# EAGLE design ioboard (EAGLE 9.6.2)
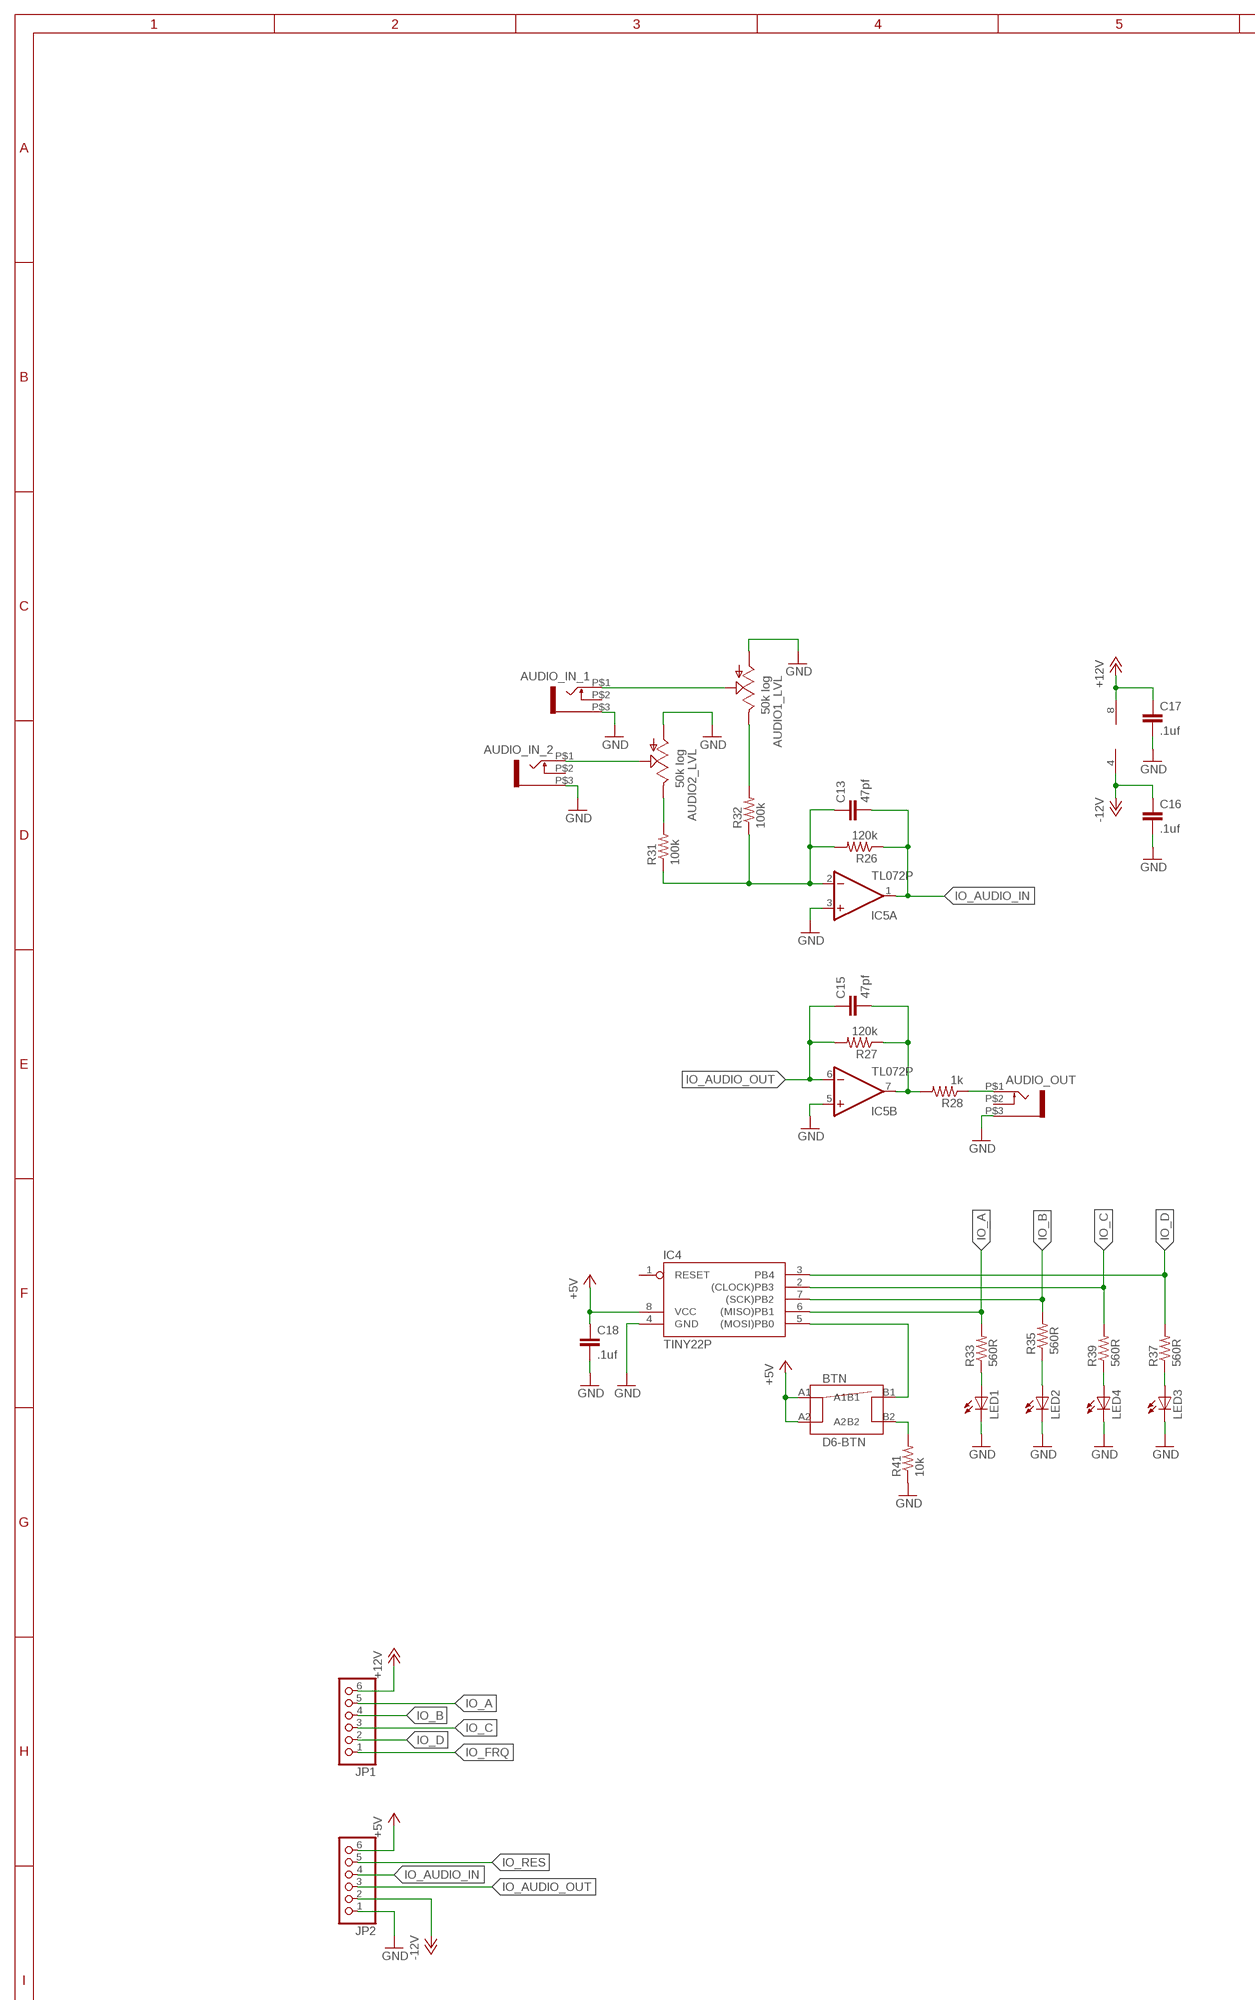
[diagram p0: schematic, sheet 1, part 1 of 2]
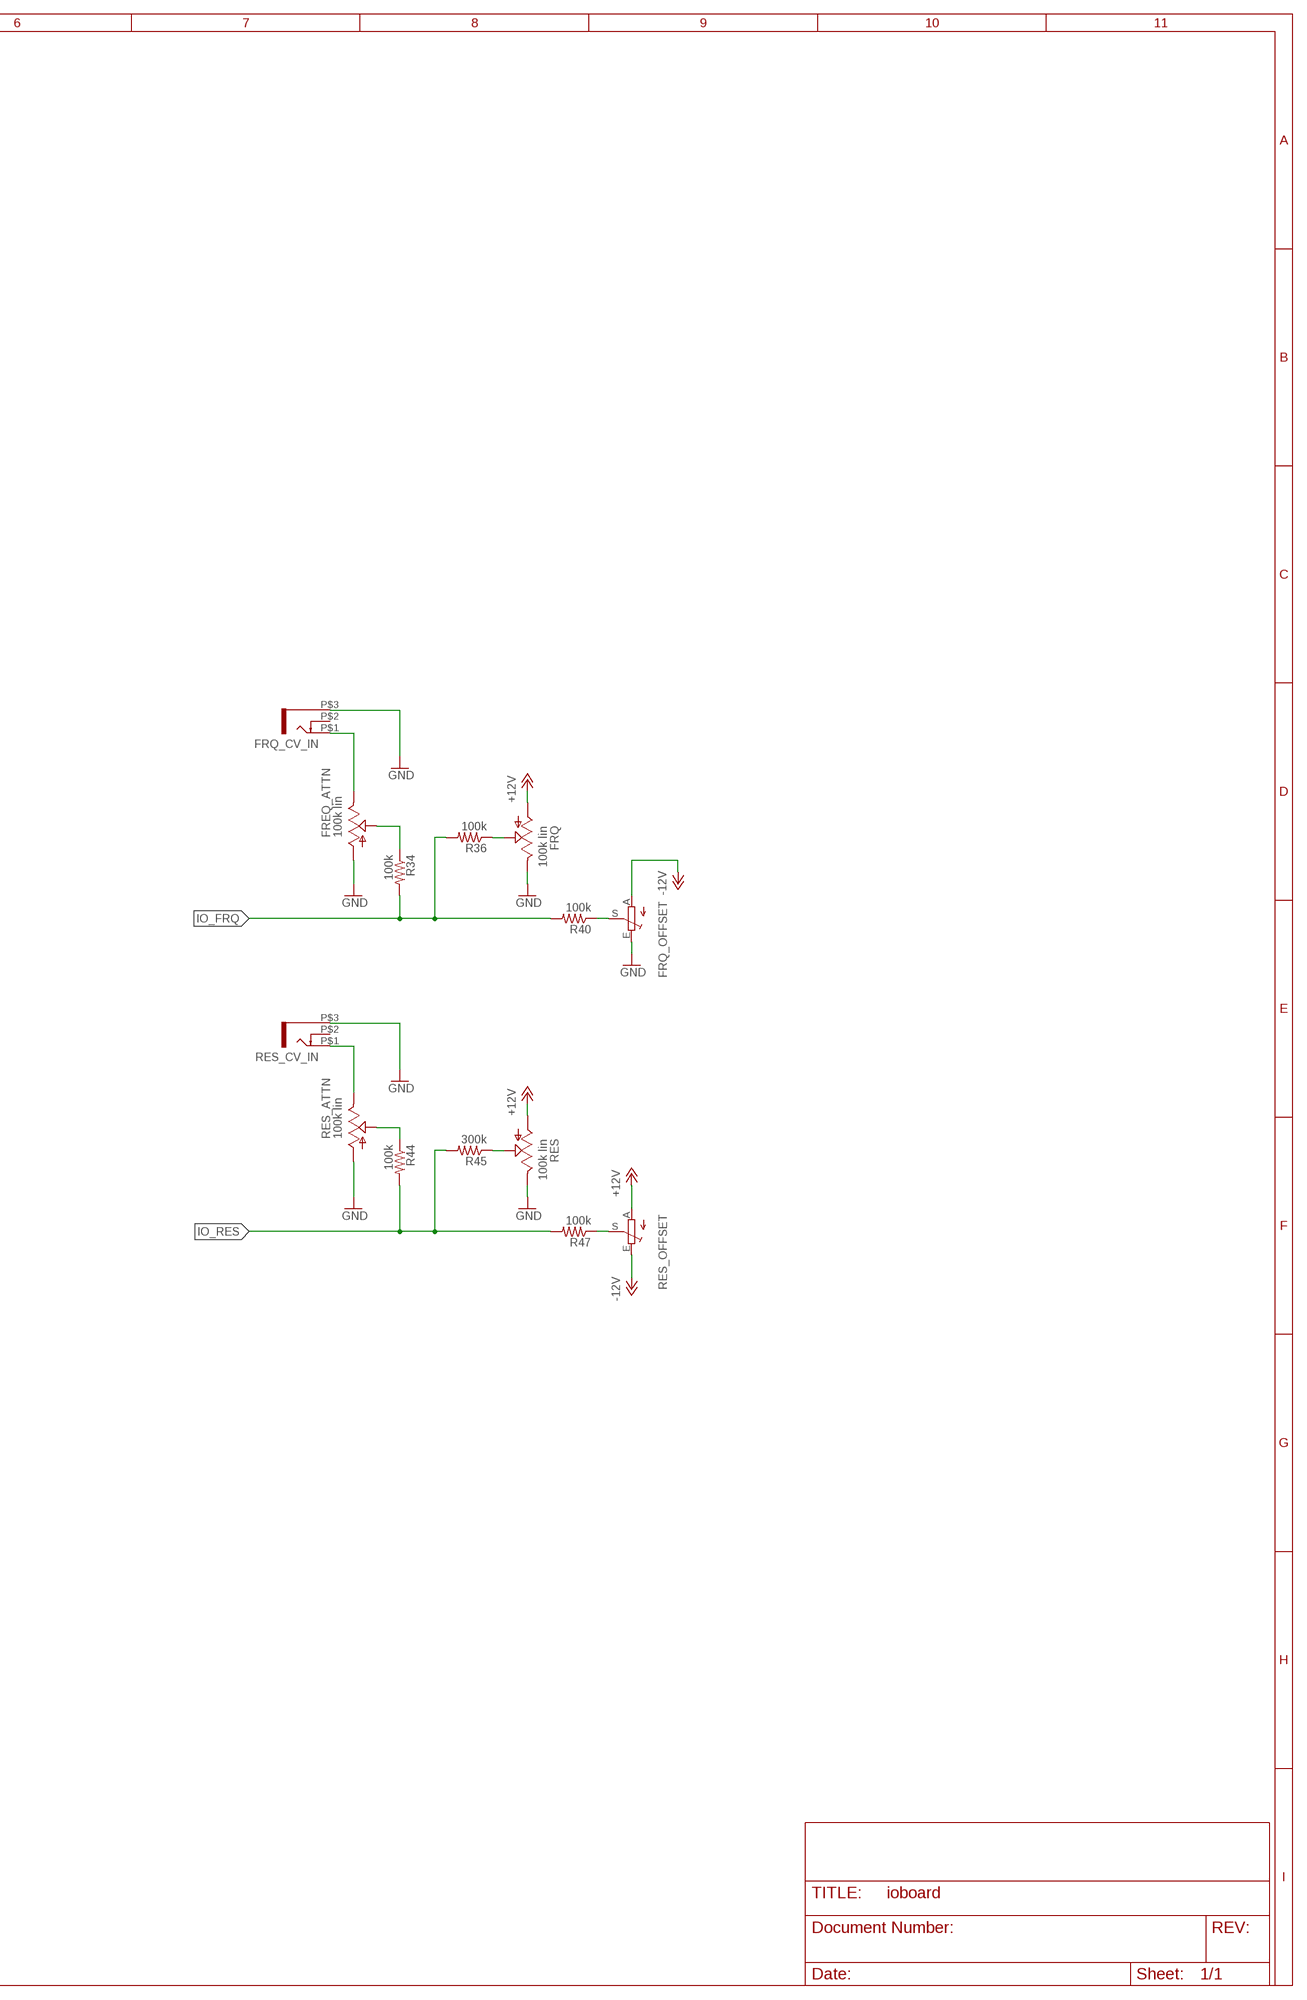
[diagram p1: schematic, sheet 1, part 2 of 2]

## Parts
AUDIO1_LVL  50k log  ALPHA-9MMA  [EVUF]
AUDIO2_LVL  50k log  ALPHA-9MMA  [EVUF]
AUDIO_IN_1  WQP-PJ301M-12_JACK  [WQP-PJ301M-12_JACK]
AUDIO_IN_2  WQP-PJ301M-12_JACK  [WQP-PJ301M-12_JACK]
AUDIO_OUT  WQP-PJ301M-12_JACK  [WQP-PJ301M-12_JACK]
BTN  D6-BTN  [D6-BTN]
C13  47pf  C-EU050-024X044  [C050-024X044]
C15  47pf  C-EU050-024X044  [C050-024X044]
C16  .1uf  C-EU050-024X044  [C050-024X044]
C17  .1uf  C-EU050-024X044  [C050-024X044]
C18  .1uf  C-EU050-024X044  [C050-024X044]
FREQ_ATTN  100k lin  ALPHA-9MMA  [EVUF]
FRQ  100k lin  ALPHA-9MMA  [EVUF]
FRQ_CV_IN  WQP-PJ301M-12_JACK  [WQP-PJ301M-12_JACK]
FRQ_OFFSET  TRIM_EU-B25P  [B25P]
IC4  TINY22P  [DIL08]
IC5  TL072P  [DIL08]
JP1  PINHD-1X6  [1X06]
JP2  PINHD-1X6  [1X06]
LED1  LED3MM  [LED3MM]
LED2  LED3MM  [LED3MM]
LED3  LED3MM  [LED3MM]
LED4  LED3MM  [LED3MM]
R26  120k  R-US_0207/7  [0207/7]
R27  120k  R-US_0207/7  [0207/7]
R28  1k  R-US_0207/7  [0207/7]
R31  100k  R-US_0207/7  [0207/7]
R32  100k  R-US_0207/7  [0207/7]
R33  560R  R-US_0207/7  [0207/7]
R34  100k  R-US_0207/7  [0207/7]
R35  560R  R-US_0207/7  [0207/7]
R36  100k  R-US_0207/7  [0207/7]
R37  560R  R-US_0207/7  [0207/7]
R39  560R  R-US_0207/7  [0207/7]
R40  100k  R-US_0207/7  [0207/7]
R41  10k  R-US_0207/7  [0207/7]
R44  100k  R-US_0207/7  [0207/7]
R45  300k  R-US_0207/7  [0207/7]
R47  100k  R-US_0207/7  [0207/7]
RES  100k lin  ALPHA-9MMA  [EVUF]
RES_ATTN  100k lin  ALPHA-9MMA  [EVUF]
RES_CV_IN  WQP-PJ301M-12_JACK  [WQP-PJ301M-12_JACK]
RES_OFFSET  TRIM_EU-B25P  [B25P]

## Nets
+5V: BTN.A1 BTN.A2 C18.1 IC4.8(VCC) JP2.6
+12V: C17.1 FRQ.1(A) IC5.8(P:V+) JP1.6 RES.1(A) RES_OFFSET.A
-12V: C16.1 FRQ_OFFSET.A IC5.4(P:V-) JP2.2 RES_OFFSET.E
GND: AUDIO1_LVL.1(A) AUDIO2_LVL.1(A) AUDIO_IN_1.P$3 AUDIO_IN_2.P$3 AUDIO_OUT.P$3 C16.2 C17.2 C18.2 FREQ_ATTN.1(A) FRQ.3(E) FRQ_CV_IN.P$3 FRQ_OFFSET.E IC4.4(GND) IC5.3(A:+IN) IC5.5(B:+IN) JP2.1 LED1.K(C) LED2.K(C) LED3.K(C) LED4.K(C) R41.1 RES.3(E) RES_ATTN.1(A) RES_CV_IN.P$3
IO_A: IC4.6((MISO)PB1) JP1.5 R33.2
IO_AUDIO_IN: C13.2 IC5.1(A:OUT) JP2.4 R26.1
IO_AUDIO_OUT: C15.1 IC5.6(B:-IN) JP2.3 R27.2
IO_B: IC4.7((SCK)PB2) JP1.4 R35.2
IO_C: IC4.2((CLOCK)PB3) JP1.3 R39.2
IO_D: IC4.3(PB4) JP1.2 R37.2
IO_FRQ: JP1.1 R34.2 R36.2 R40.2
IO_RES: JP2.5 R44.2 R45.2 R47.2
N$8: AUDIO_OUT.P$1 R28.1
N$15: C15.2 IC5.7(B:OUT) R27.1 R28.2
N$30: C13.1 IC5.2(A:-IN) R26.2 R31.1 R32.1
N$33: AUDIO2_LVL.3(E) R31.2
N$34: AUDIO1_LVL.3(E) R32.2
N$35: AUDIO2_LVL.2(S) AUDIO_IN_2.P$1
N$36: AUDIO1_LVL.2(S) AUDIO_IN_1.P$1
N$37: LED1.A R33.1
N$38: FREQ_ATTN.3(E) FRQ_CV_IN.P$1
N$39: FREQ_ATTN.2(S) R34.1
N$40: FRQ.2(S) R36.1
N$41: FRQ_OFFSET.S R40.1
N$42: LED2.A R35.1
N$43: RES_ATTN.3(E) RES_CV_IN.P$1
N$44: LED4.A R39.1
N$45: BTN.B2 R41.2
N$46: BTN.B1 IC4.5((MOSI)PB0)
N$47: R44.1 RES_ATTN.2(S)
N$48: R45.1 RES.2(S)
N$49: LED3.A R37.1
N$50: R47.1 RES_OFFSET.S
Unconnected: AUDIO_IN_1.P$2 AUDIO_IN_2.P$2 AUDIO_OUT.P$2 FRQ_CV_IN.P$2 IC4.1(RESET) RES_CV_IN.P$2

## Library data of the parts
AUDIO1_LVL AUDIO2_LVL FREQ_ATTN FRQ RES RES_ATTN = TomW:ALPHA-9MM: 9 mm Square Rotary Potentiometers Source: Panasonic
AUDIO_IN_1 AUDIO_IN_2 AUDIO_OUT FRQ_CV_IN RES_CV_IN = thonkiconn:WQP-PJ301M-12_JACK
BTN = gerbster:D6-BTN
C13 C15-C18 = resistor:C-EU: CAPACITOR, European symbol
FRQ_OFFSET RES_OFFSET = pot:TRIM_EU-: POTENTIOMETER
IC4 = avr-7:TINY22: MICROCONTROLLER 1K ROM 128 bytes RAM 128 bytes EEPROM
IC5 = TomW:TL072: OP AMP
JP1 JP2 = pinhead:PINHD-1X6: PIN HEADER
LED1-LED4 = led:LED: LED OSRAM: - CHIPLED LG R971, LG N971, LY N971, LG Q971, LY Q971, LO R971, LY R971 LH N974, LH R974 LS Q976, LO Q976, LY Q976 LO Q996 - Hyper CHIPLED LW Q18S LB Q993, LB Q99A, LB R99A - SideLED LS A670, LO A670, LY A670, LG A670, LP A670 LB A673, LV A673, LT A673, LW A673 LH A674 LY A675 LS A676, LA A676, LO A676, LY A676, LW A676 LS A679, LY A679, LG A679 - Hyper Micro SIDELED® LS Y876, LA Y876, LO Y876, LY Y876 LT Y87S - SmartLED LW L88C, LW L88S LB L89C, LB L89S, LG L890 LS L89K, LO L89K, LY L89K LS L896, LA L896, LO L896, LY L896 - TOPLED LS T670, LO T670, LY T670, LG T670, LP T670 LSG T670, LSP T670, LSY T670, LOP T670, LYG T670 LG T671, LOG T671, LSG T671 LB T673, LV T673, LT T673, LW T673 LH T674 LS T676, LA T676, LO T676, LY T676, LB T676, LH T676, LSB T676, LW T676 LB T67C, LV T67C, LT T67C, LS T67K, LO T67K, LY T67K, LW E67C LS E67B, LA E67B, LO E67B, LY E67B, LB E67C, LV E67C, LT E67C LW T67C LS T679, LY T679, LG T679 LS T770, LO T770, LY T770, LG T770, LP T770 LB T773, LV T773, LT T773, LW T773 LH T774 LS E675, LA E675, LY E675, LS T675 LS T776, LA T776, LO T776, LY T776, LB T776 LHGB T686 LT T68C, LB T68C - Hyper Mini TOPLED® LB M676 - Mini TOPLED Santana® LG M470 LS M47K, LO M47K, LY M47K Source: http://www.osram.convergy.de LUXEON: - LUMILED® LXK2-PW12-R00, LXK2-PW12-S00, LXK2-PW14-U00, LXK2-PW14-V00 LXK2-PM12-R00, LXK2-PM12-S00, LXK2-PM14-U00 LXK2-PE12-Q00, LXK2-PE12-R00, LXK2-PE12-S00, LXK2-PE14-T00, LXK2-PE14-U00 LXK2-PB12-K00, LXK2-PB12-L00, LXK2-PB12-M00, LXK2-PB14-N00, LXK2-PB14-P00, LXK2-PB14-Q00 LXK2-PR12-L00, LXK2-PR12-M00, LXK2-PR14-Q00, LXK2-PR14-R00 LXK2-PD12-Q00, LXK2-PD12-R00, LXK2-PD12-S00 LXK2-PH12-R00, LXK2-PH12-S00 LXK2-PL12-P00, LXK2-PL12-Q00, LXK2-PL12-R00 Source: www.luxeon.com KINGBRIGHT: KA-3528ASYC Source: www.kingbright.com
R26-R28 R31-R37 R39-R41 R44 R45 R47 = resistor:R-US_: RESISTOR, American symbol

## Board
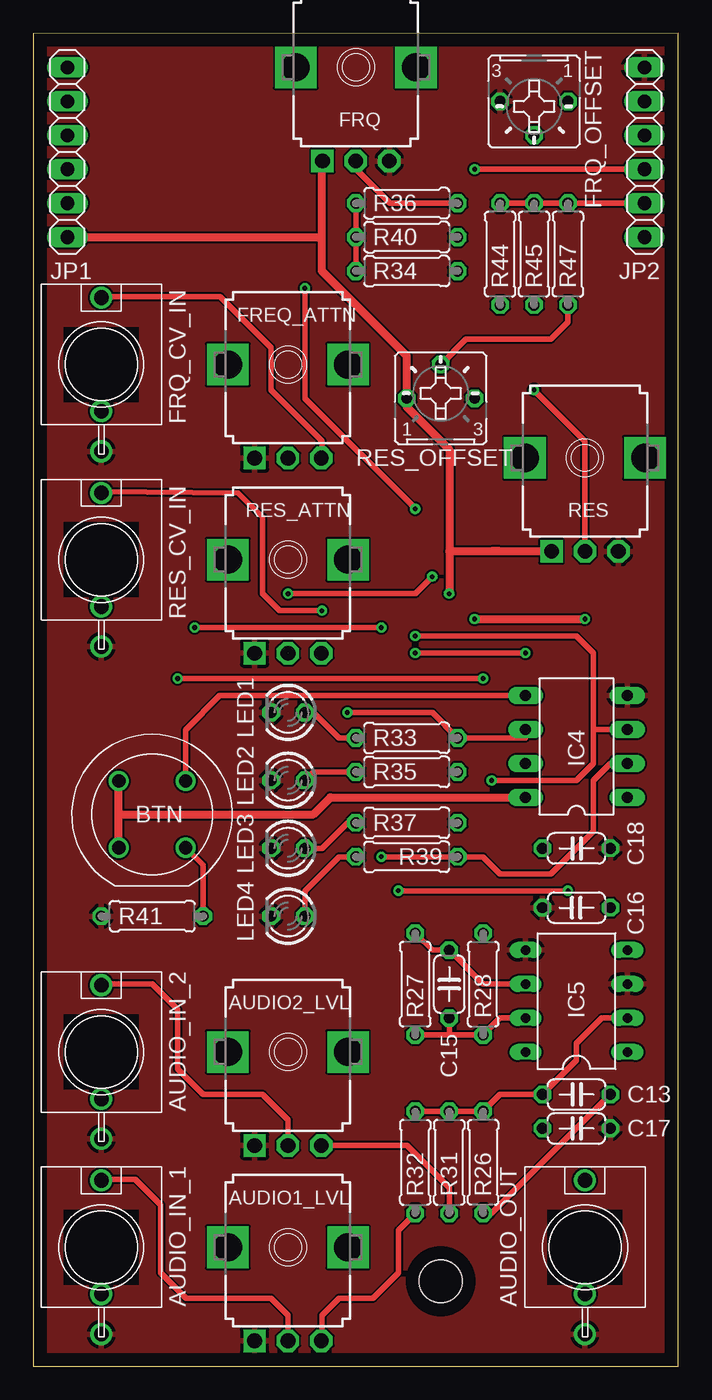
[diagram p2: board, top side]
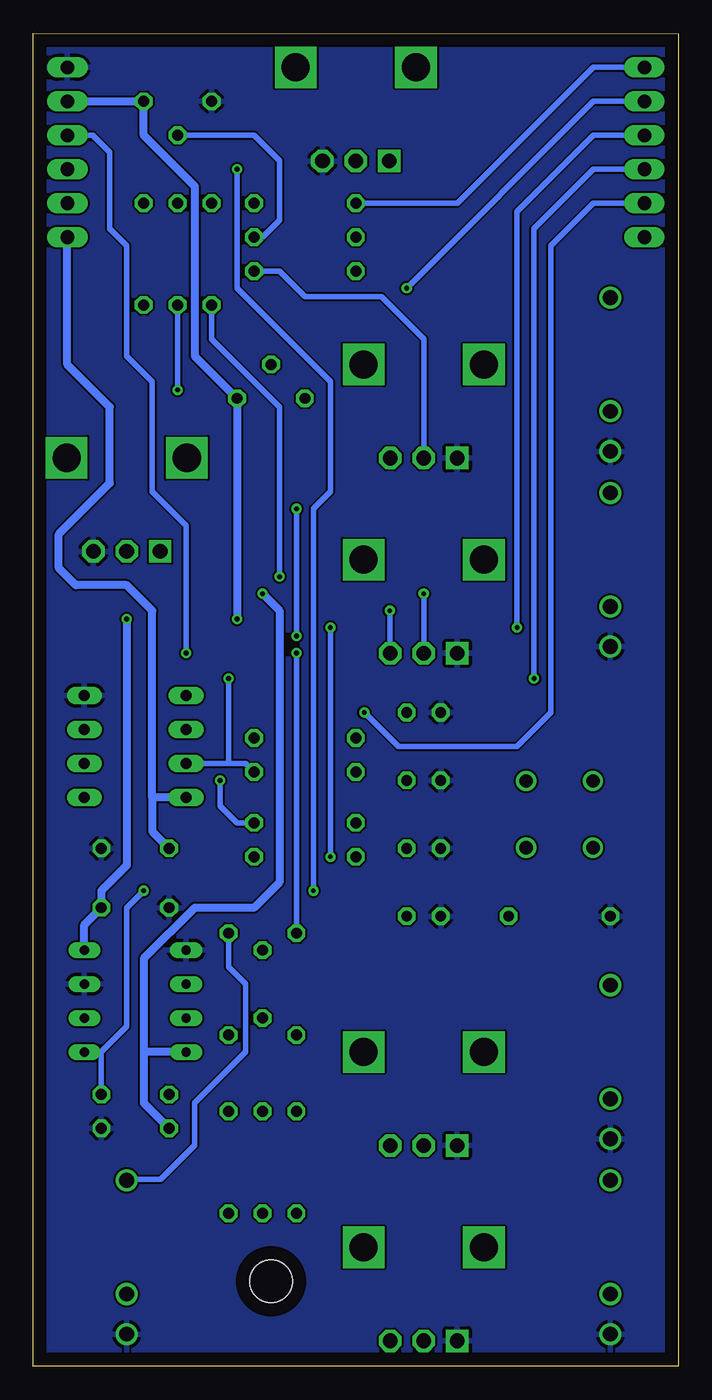
[diagram p3: board, bottom side, seen from below]

Size 48.26 x 99.69 mm. Coordinates in mm from the lower left corner, seen from the top.
Outline: 0,0 48.26,0 48.26,99.69 0,99.69 0,0
Copper layers (1*16): Top 0.035mm / dielectric 1.5mm / Bottom 0.035mm
Design rules "default": minimum track width 6mil, minimum drill 0.35mm, track to track 6mil, track to pad 6mil, pad to pad 6mil, via to via 6mil, smd to smd 6mil, copper to edge 40mil, drill to drill 6mil, minimum pad ring 10mil, minimum via ring 8mil, stop-mask expansion 4mil, vias tented up to drill 0mil, thermal gap 10mil
Holes 3.2 mm at 30.48,6.35

### Footprints (pad centres in the part's own frame; a part is rotated, then mirrored left to right if it is on the bottom)
EVUF = drill 1.1 pad 1.676 square: 1 -2.5,-7 | drill 1.1 pad 1.676 octagon: 2 0,-7; 3 2.5,-7 | drill 2.1 pad 2.8 square: M1 4.5,0; M2 -4.5,0
WQP-PJ301M-12_JACK = drill 1.1: P$1 0,5; P$2 0,-3.5; P$3 0,-6.5
D6-BTN = drill 1: A1 -2.5,2.5; A2 -2.5,-2.5; B1 2.5,2.5; B2 2.5,-2.5
C050-024X044 = drill 0.813 octagon: 1 -2.54,0; 2 2.54,0
B25P = drill 0.813 octagon: A -2.54,0; E 2.54,0; S 0,2.54
DIL08 = drill 0.813 long: 1 -3.81,-3.81; 2 -1.27,-3.81; 3 1.27,-3.81; 4 3.81,-3.81; 5 3.81,3.81; 6 1.27,3.81; 7 -1.27,3.81; 8 -3.81,3.81
DIL08' = drill 0.7 long: 1 -3.81,-3.81; 2 -1.27,-3.81; 3 1.27,-3.81; 4 3.81,-3.81; 5 3.81,3.81; 6 1.27,3.81; 7 -1.27,3.81; 8 -3.81,3.81
1X06 = drill 1.016 long: 1 -6.35,0; 2 -3.81,0; 3 -1.27,0; 4 1.27,0; 5 3.81,0; 6 6.35,0
LED3MM = drill 0.813 octagon: A -1.27,0; K 1.27,0
0207/7 = drill 0.813 octagon: 1 -3.81,0; 2 3.81,0

### Placement (x,y rotation side)
AUDIO1_LVL  19.05,8.89 0 top
AUDIO2_LVL  19.05,23.5 0 top
AUDIO_IN_1  5.08,8.89 0 top
AUDIO_IN_2  5.08,23.5 0 top
AUDIO_OUT  41.27,8.89 0 top
BTN  8.89,41.27 0 top
C13  40.64,20.32 0 top
C15  31.11,28.57 270 top
C16  40.64,34.29 180 top
C17  40.64,17.78 0 top
C18  40.64,38.73 0 top
FREQ_ATTN  19.05,74.93 0 top
FRQ  24.13,97.16 0 top
FRQ_CV_IN  5.08,74.93 0 top
FRQ_OFFSET  37.47,94.61 180 top
IC4  40.64,46.35 90 top
IC5  TL072P  [DIL08']  40.64,27.3 90 top
JP1  2.54,90.81 270 top
JP2  45.72,90.81 270 top
LED1  19.05,48.9 180 top
LED2  19.05,43.81 180 top
LED3  19.05,38.73 180 top
LED4  19.05,33.66 180 top
R26  33.66,15.24 90 top
R27  28.57,28.57 90 top
R28  33.66,28.57 270 top
R31  31.11,15.24 270 top
R32  28.57,15.24 270 top
R33  27.94,46.99 0 top
R34  27.94,81.92 180 top
R35  27.94,44.45 0 top
R36  27.94,87 180 top
R37  27.94,40.64 0 top
R39  27.94,38.1 0 top
R40  27.94,84.45 180 top
R41  8.89,33.66 0 top
R44  34.92,83.19 90 top
R45  37.47,83.19 90 top
R47  40.01,83.19 90 top
RES  41.27,67.94 0 top
RES_ATTN  19.05,60.33 0 top
RES_CV_IN  5.08,60.33 0 top
RES_OFFSET  30.48,72.39 0 top

### Tracks (layer width: path | path; a pad name or v marks a point on that pad's centre or on a via)
+5V
  Top 0.406: 6.35,43.81 BTN.A1 6.35,43.77 | 6.35,38.73 BTN.A2 | 6.35,40.64 6.35,41.27
  Top 0.61: 6.35,43.81 6.35,38.73 | 6.35,43.77 6.35,41.27 20.95,41.27 22.23,42.55 IC4.8
  Bottom 0.61: IC4.8 39.37,42.55 | 39.37,42.55 39.37,40.01 C18.1 | JP2.6 45.72,74.93 42.55,71.75 42.55,66.04 46.35,62.23 46.35,59.69 45.09,58.42 41.27,58.42 39.37,56.52 39.37,42.55
+12V  (via drill 0.35)
  Top 0.406: 21.59,90.16 FRQ.1 | RES.1 38.73,60.95
  Top 0.61: 31.11,60.96 31.11,68.58 27.94,71.75 RES_OFFSET.A 27.94,75.56 21.59,81.92 21.59,84.45 | 31.11,60.96 34.29,60.96 | 34.29,60.96 38.73,60.95 34.92,60.96 34.29,60.96 | 21.59,84.45 21.59,90.16 | JP1.6 21.59,84.45 | 31.11,60.96 v31.11,57.78
  Bottom 0.61: IC5.8 40.01,23.5 | 40.01,23.5 40.01,19.68 C17.1 | v31.11,57.78 29.84,56.52 29.84,36.2 31.75,34.29 36.2,34.29 40.01,30.48 40.01,23.5
-12V  (via drill 0.35)
  Top 0.61: v33.02,55.88 v41.27,55.88
  Bottom 0.61: JP2.2 FRQ_OFFSET.A 40.01,92.08 36.2,88.27 36.2,75.56 RES_OFFSET.E v33.02,55.88 | v41.27,55.88 41.27,37.47 43.18,35.56 C16.1 44.45,33.02 IC5.4
GND
  pour Top: 0,99.69 48.26,99.69 48.26,0 0,0
  pour Bottom: 0,99.69 48.26,99.69 48.26,0 0,0
IO_A  (via drill 0.35)
  Top 0.406: IC4.6 36.83,46.99 R33.2 29.84,48.9 v23.5,48.9
  Bottom 0.406: JP1.5 6.35,87 9.53,83.82 9.53,48.9 12.06,46.35 20.95,46.35 v23.5,48.9
IO_AUDIO_IN  (via drill 0.35)
  Top 0.406: R26.1 34.29,11.43 C13.2 | v40.01,35.56 v27.3,35.56 | v33.02,89.53 JP2.4
  Bottom 0.406: C13.2 43.18,23.5 | IC5.1 43.18,23.5 | 43.18,23.5 41.27,25.4 41.27,34.29 v40.01,35.56 | v27.3,35.56 27.3,64.14 26.04,65.41 26.04,73.66 33.02,80.64 v33.02,89.53
IO_AUDIO_OUT  (via drill 0.35)
  Top 0.406: IC5.6 33.66,28.57 C15.1 29.84,31.11 R27.2 | v36.83,53.34 v28.57,53.34
  Bottom 0.406: JP2.3 43.81,92.08 42.55,90.81 42.55,85.09 41.27,83.82 41.27,75.56 39.37,73.66 39.37,65.41 36.83,62.87 v36.83,53.34 | v28.57,53.34 R27.2
IO_B  (via drill 0.35)
  Top 0.406: v10.79,51.44 v33.66,51.44
  Bottom 0.406: 33.66,45.09 IC4.7 | JP1.4 6.35,89.53 10.79,85.09 v10.79,51.44 | 33.66,45.09 32.38,45.09 R35.2 | v33.66,51.44 33.66,45.09
IO_C  (via drill 0.35)
  Top 0.406: IC4.2 43.18,45.09 41.91,43.81 41.91,40.01 38.73,36.83 34.92,36.83 33.66,38.1 R39.2 v26.04,38.1 | v12.06,55.24 v26.04,55.24
  Bottom 0.406: JP1.3 6.35,92.08 12.06,86.36 v12.06,55.24 | v26.04,55.24 v26.04,38.1
IO_D  (via drill 0.35)
  Top 0.406: 41.91,47.62 41.91,45.09 40.64,43.81 v34.29,43.81 | 41.91,47.62 IC4.3 | v20.32,80.64 20.32,72.39 v28.57,64.14 | v28.57,54.61 40.64,54.61 41.91,53.34 41.91,47.62
  Bottom 0.406: R37.2 33.02,40.64 34.29,41.91 v34.29,43.81 | JP1.2 6.35,94.61 v20.32,80.64 | v28.57,64.14 v28.57,54.61
IO_FRQ
  Top 0.406: R36.2 R40.2 R34.2
  Bottom 0.406: JP1.1 6.35,97.16 16.51,87 R36.2
IO_RES
  Top 0.406: JP2.5 R47.2 R45.2 R44.2
N$8
  Bottom 0.406: R28.1 33.66,29.84 32.38,28.57 32.38,23.5 36.2,19.68 36.2,16.51 38.73,13.97 41.27,13.97 arc-60 AUDIO_OUT.P$1
N$15
  Top 0.406: R27.1 31.11,24.77 | 31.11,24.77 C15.2 | 31.11,24.77 R28.2 34.92,26.04 IC5.7
N$30
  Top 0.406: R32.1 R31.1 R26.2 34.92,20.32 C13.1 40.64,22.86 40.64,24.13 42.55,26.04 IC5.2
N$33
  Top 0.406: AUDIO2_LVL.3 27.93,16.5 27.94,16.51 31.11,13.32 R31.2
N$34
  Top 0.406: AUDIO1_LVL.3 21.55,1.91 21.59,3.17 21.59,3.81 22.86,5.08 25.4,5.08 27.3,6.99 27.3,10.16 R32.2
N$35
  Top 0.406: AUDIO_IN_2.P$1 5.08,28.57 8.89,28.57 10.79,26.67 10.79,22.23 12.7,20.32 17.14,20.32 19.05,18.41 AUDIO2_LVL.2
N$36
  Top 0.406: AUDIO_IN_1.P$1 5.16,13.97 7.62,13.97 9.53,12.06 9.53,6.99 11.43,5.08 17.78,5.08 17.78,5.07 19.05,3.79 AUDIO1_LVL.2
N$37
  Top 0.406: R33.1 22.86,46.99 20.95,48.9 LED1.A
N$38
  Top 0.406: FRQ_CV_IN.P$1 5.08,80.01 13.97,80.01 17.78,76.2 17.78,73.03 21.59,69.22 21.59,67.93 FREQ_ATTN.3
N$39
  Bottom 0.406: FREQ_ATTN.2 19.05,76.83 22.23,80.01 27.94,80.01 29.84,81.92 R34.1
N$40
  Top 0.406: FRQ.2 24.13,89.53 26.67,87 R36.1
N$41
  Bottom 0.406: R40.1 31.11,84.45 29.84,85.72 29.84,90.17 31.75,92.08 FRQ_OFFSET.S
N$42
  Top 0.406: LED2.A 20.95,44.45 R35.1
N$43  (via drill 0.35)
  Top 0.406: RES_CV_IN.P$1 5.08,65.41 15.32,65.33 17.14,63.5 17.14,57.78 18.41,56.52 v21.59,56.52 | v21.59,53.33 RES_ATTN.3
  Bottom 0.406: v21.59,56.52 v21.59,53.33
N$44
  Top 0.406: R39.1 22.86,38.1 20.32,35.56 LED4.A
N$45
  Top 0.406: BTN.B2 12.7,37.51 R41.2
N$46
  Top 0.406: BTN.B1 11.39,47.59 11.43,47.62 13.93,50.16 IC4.5
N$47  (via drill 0.35)  (1 unrouted)
  Top 0.406: v29.84,59.05 28.57,57.78 v19.05,57.78
  Bottom 0.406: R44.1 34.92,76.83 29.84,71.75 v29.84,59.05 | v19.05,57.78 RES_ATTN.2
N$48  (via drill 0.35)
  Top 0.406: RES.2 41.27,69.22 v37.47,73.03
  Bottom 0.406: R45.1 v37.47,73.03
N$49
  Top 0.406: R37.1 23.5,40.64 21.59,38.73 LED3.A
N$50
  Top 0.406: R47.1 40.01,78.11 38.73,76.83 32.38,76.83 RES_OFFSET.S